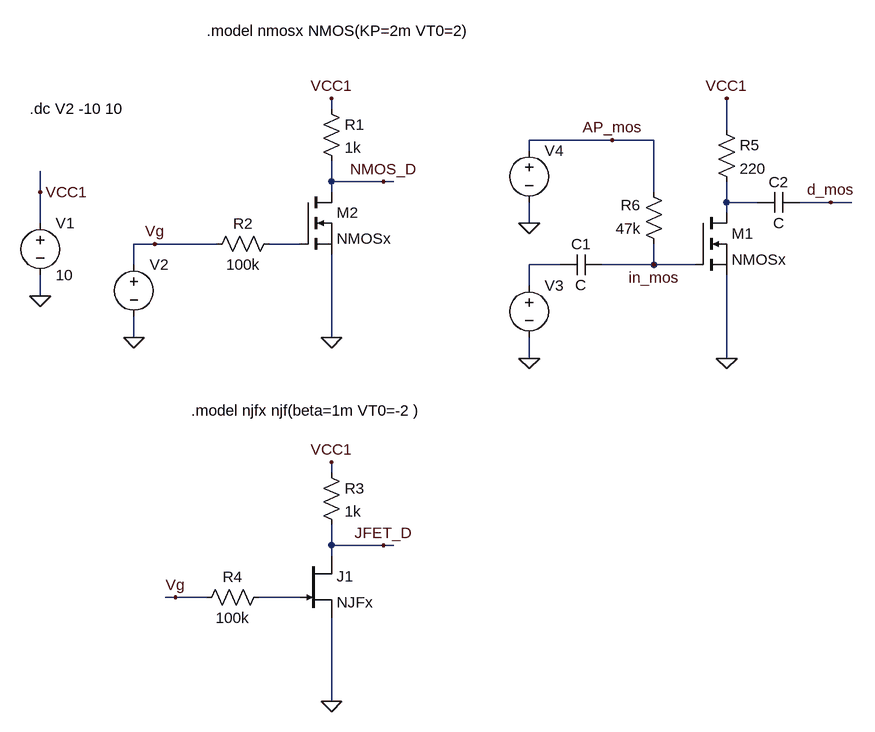
[diagram p0: schematic BS170_Kennwerte.asc]
BS170_Kennwerte.asc, the LTspice schematic file:
Version 4
SHEET 1 1408 900
WIRE 192 -32 192 -48
WIRE 800 0 800 -48
WIRE 624 16 496 16
WIRE 688 16 624 16
WIRE 496 32 496 16
WIRE 192 80 192 48
WIRE 272 80 192 80
WIRE 288 80 272 80
WIRE -256 96 -256 64
WIRE 192 96 192 80
WIRE 688 96 688 16
WIRE 800 112 800 80
WIRE 848 112 800 112
WIRE 960 112 912 112
WIRE 992 112 960 112
WIRE 800 128 800 112
WIRE -256 144 -256 96
WIRE 496 144 496 112
WIRE -80 176 -112 176
WIRE 16 176 -80 176
WIRE 144 176 96 176
WIRE -112 208 -112 176
WIRE 544 208 496 208
WIRE 688 208 688 176
WIRE 688 208 608 208
WIRE 752 208 688 208
WIRE 496 240 496 208
WIRE -256 256 -256 224
WIRE -112 320 -112 288
WIRE 192 320 192 192
WIRE 496 352 496 320
WIRE 800 352 800 224
WIRE 192 528 192 512
WIRE 192 640 192 608
WIRE 272 640 192 640
WIRE 288 640 272 640
WIRE 192 656 192 640
WIRE -48 720 -64 720
WIRE 0 720 -48 720
WIRE 144 720 80 720
WIRE 192 880 192 752
FLAG 192 320 0
FLAG -256 256 0
FLAG -112 320 0
FLAG -256 96 VCC1
FLAG 192 -48 VCC1
FLAG 192 880 0
FLAG 192 512 VCC1
FLAG -80 176 Vg
FLAG -48 720 Vg
FLAG 272 640 JFET_D
FLAG 272 80 NMOS_D
FLAG 800 352 0
FLAG 496 352 0
FLAG 800 -48 VCC1
FLAG 496 144 0
FLAG 624 16 AP_mos
FLAG 688 208 in_mos
FLAG 960 112 d_mos
SYMBOL voltage -256 128 R0
WINDOW 123 0 0 Left 2
WINDOW 39 0 0 Left 2
SYMATTR InstName V1
SYMATTR Value 10
SYMBOL res 176 -48 R0
SYMATTR InstName R1
SYMATTR Value 1k
SYMBOL voltage -112 192 R0
WINDOW 123 0 0 Left 2
WINDOW 39 0 0 Left 2
SYMATTR InstName V2
SYMATTR Value ""
SYMBOL res 112 160 R90
WINDOW 0 0 56 VBottom 2
WINDOW 3 32 56 VTop 2
SYMATTR InstName R2
SYMATTR Value 100k
SYMBOL nmos 144 96 R0
SYMATTR InstName M2
SYMATTR Value NMOSx
SYMBOL njf 144 656 R0
SYMATTR InstName J1
SYMATTR Value NJFx
SYMBOL res 176 512 R0
SYMATTR InstName R3
SYMATTR Value 1k
SYMBOL res 96 704 R90
WINDOW 0 0 56 VBottom 2
WINDOW 3 32 56 VTop 2
SYMATTR InstName R4
SYMATTR Value 100k
SYMBOL res 784 -16 R0
SYMATTR InstName R5
SYMATTR Value 220
SYMBOL voltage 496 224 R0
WINDOW 123 0 0 Left 2
WINDOW 39 0 0 Left 2
SYMATTR InstName V3
SYMATTR Value ""
SYMBOL res 704 192 R180
WINDOW 0 36 76 Left 2
WINDOW 3 36 40 Left 2
SYMATTR InstName R6
SYMATTR Value 47k
SYMBOL nmos 752 128 R0
SYMATTR InstName M1
SYMATTR Value NMOSx
SYMBOL cap 608 192 R90
WINDOW 0 0 32 VBottom 2
WINDOW 3 32 32 VTop 2
SYMATTR InstName C1
SYMBOL voltage 496 16 R0
WINDOW 123 0 0 Left 2
WINDOW 39 0 0 Left 2
SYMATTR InstName V4
SYMATTR Value ""
SYMBOL cap 912 96 R90
WINDOW 0 0 32 VBottom 2
WINDOW 3 32 32 VTop 2
SYMATTR InstName C2
TEXT -272 -32 Left 2 !.dc V2 -10 10
TEXT 0 -152 Left 2 !.model nmosx NMOS(KP=2m VT0=2)
TEXT -24 432 Left 2 !.model njfx njf(beta=1m VT0=-2 )

The netlist it stands for:
* BS170_Kennwerte.asc
V1 VCC1 0 10
R1 VCC1 NMOS_D 1k
V2 Vg 0
R2 N002 Vg 100k
M2 NMOS_D N002 0 0 NMOSx
J1 JFET_D N004 0 NJFx
R3 VCC1 JFET_D 1k
R4 N004 Vg 100k
R5 VCC1 N001 220
V3 N003 0
R6 in_mos AP_mos 47k
M1 N001 in_mos 0 0 NMOSx
C1 in_mos N003 C
V4 AP_mos 0
C2 d_mos N001 C
.model NJF NJF
.model PJF PJF
.lib standard.jft
.model NMOS NMOS
.model PMOS PMOS
.lib standard.mos
.dc V2 -10 10
.model nmosx NMOS(KP=2m VT0=2)
.model njfx njf(beta=1m VT0=-2 )
.backanno
.end